# Altium schematic sheet Inverter.SchDoc
size A4
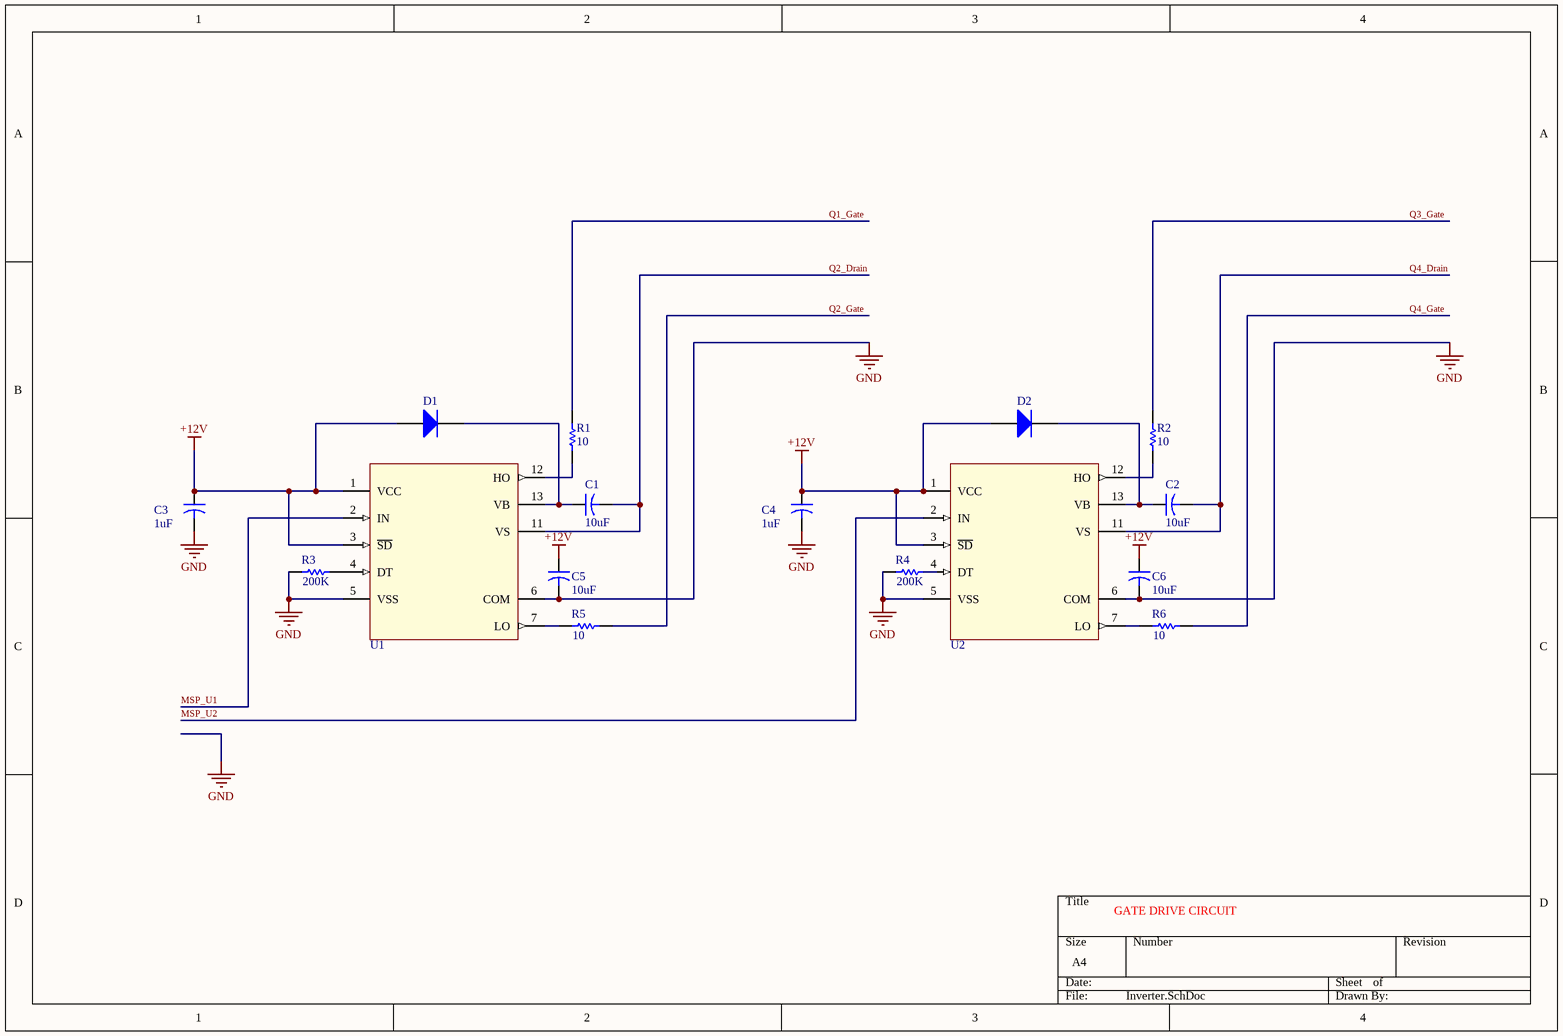
[diagram p0: Inverter.SchDoc]

## Parts
C1  value 10uF  [CAPR5-4X5]  (hidden comment: Cap2)
C2  value 10uF  [CAPR5-4X5]  (hidden comment: Cap2)
C3  value 1uF  [CAPR5-4X5]  (hidden comment: Cap2)
C4  value 1uF  [CAPR5-4X5]  (hidden comment: Cap2)
C5  value 10uF  [CAPR5-4X5]  (hidden comment: Cap2)
C6  value 10uF  [CAPR5-4X5]  (hidden comment: Cap2)
D1  Diode  [SMC]  (value not drawn)
D2  Diode  [SMC]  (value not drawn)
R1  value 10  [AXIAL-0.3]  (hidden comment: Res1)
R2  value 10  [AXIAL-0.3]  (hidden comment: Res1)
R3  value 200K  [AXIAL-0.3]  (hidden comment: Res1)
R4  value 200K  [AXIAL-0.3]  (hidden comment: Res1)
R5  value 10  [AXIAL-0.3]  (hidden comment: Res1)
R6  value 10  [AXIAL-0.3]  (hidden comment: Res1)
U1  IR21094  (value not drawn)
U2  IR21094  (value not drawn)

## Nets
+12V: C3.1 C4.1 C5.1 C6.1 D1.1(A) D2.1(A) U1.1(VCC) U1.3(~{SD}) U2.1(VCC) U2.3(~{SD})
GND: C3.2 C4.2 C5.2 C6.2 R3.1 R4.1 U1.5(VSS) U1.6(COM) U2.5(VSS) U2.6(COM)
MSP_U1: U1.2(IN)
MSP_U2: U2.2(IN)
Q1_Gate: R1.2
Q2_Drain: C1.2 U1.11(VS)
Q2_Gate: R5.2
Q3_Gate: R2.2
Q4_Drain: C2.2 U2.11(VS)
Q4_Gate: R6.2
NetC1_1: C1.1 D1.2(K) U1.13(VB)
NetC2_1: C2.1 D2.2(K) U2.13(VB)
NetR1_1: R1.1 U1.12(HO)
NetR2_1: R2.1 U2.12(HO)
NetR3_2: R3.2 U1.4(DT)
NetR4_2: R4.2 U2.4(DT)
NetR5_1: R5.1 U1.7(LO)
NetR6_1: R6.1 U2.7(LO)

Not connected (* = marked no-connect by the designer): U1 8(NC) 9(NC) 10(NC) 14(NC); U2 8(NC) 9(NC) 10(NC) 14(NC)

## Notes on the sheet
- GATE DRIVE CIRCUIT

## Library data of the parts
C1-C6 = Cap2: Capacitor; Published: 23-Sep-2002; PackageReference: CAPR5-4X5; Publisher: Altium Limited; PackageDescription: Capacitor; 2 Leads
D1 D2 = Diode: Default Diode; Published: 8-Jun-2000; LatestRevisionDate: 17-Jul-2002; LatestRevisionNote: Re-released for DXP Platform.; PackageVersion: Sep-1996; PackageReference: SMC; Publisher: Altium Limited; PackageDescription: DO-214-AB/SMC; 2 C-Bend Leads; Body 7.9 x 5.9 mm, inc. leads (LxW); Code_JEDEC: DO-214-AB
R1-R6 = Res1: Resistor; Published: 8-Jun-2000; LatestRevisionDate: 17-Jul-2002; LatestRevisionNote: Re-released for DXP Platform.; PackageReference: AXIAL-0.3; Publisher: Altium Limited; PackageDescription: Axial Device, Thru-Hole; 2 Leads; 0.3 in Pin Spacing
U1 U2 = IR21094: Half bridge gate driver